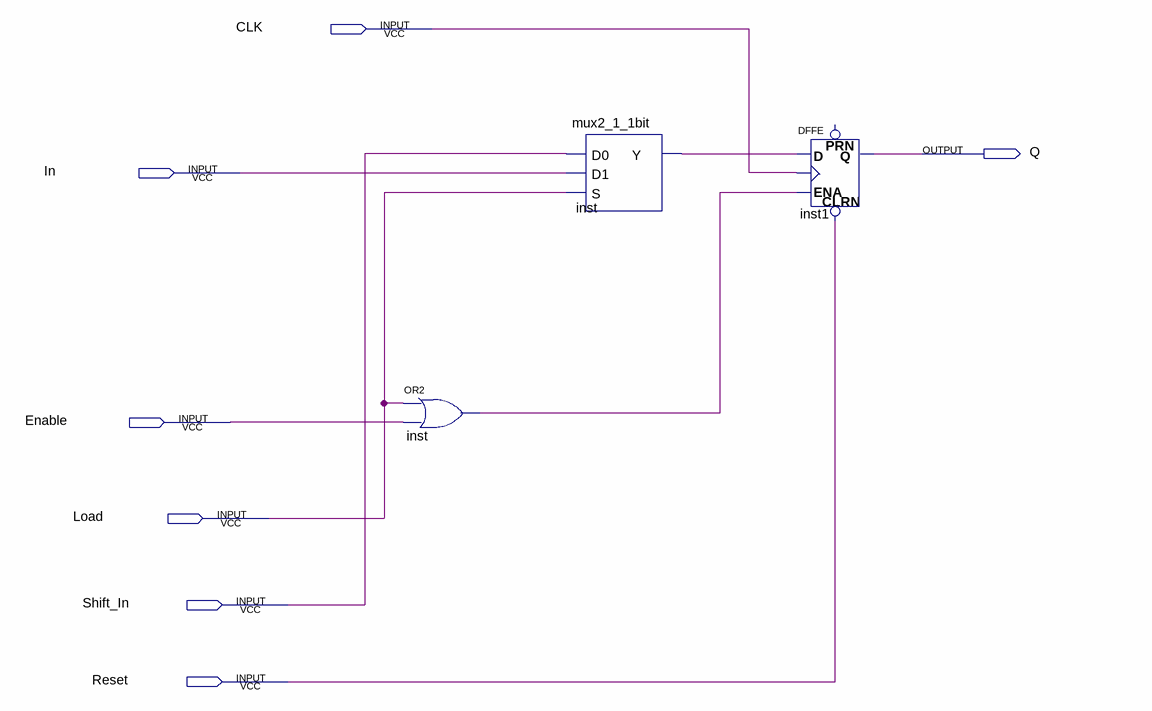
[diagram p0: schematic sheet]
// Quartus schematic ShiftLeftReg_1bit.bdf as structural Verilog: 3 symbols, 7 pins
module ShiftLeftReg_1bit (
  input  CLK,
  input  In,
  input  Enable,
  input  Load,
  input  Shift_In,
  input  Reset,
  output Q
);

  wire inst_out, inst_y;

  or inst (inst_out, Load, Enable);
  mux2_1_1bit inst_dup2 (.D0(Shift_In), .D1(In), .S(Load), .Y(inst_y));
  DFFE inst1 (.CLRN(Reset), .D(inst_y), .CLK(CLK), .ENA(inst_out), .Q(Q));  // open: PRN
endmodule
